# Altium schematic sheet Sheet5.SchDoc
size A0
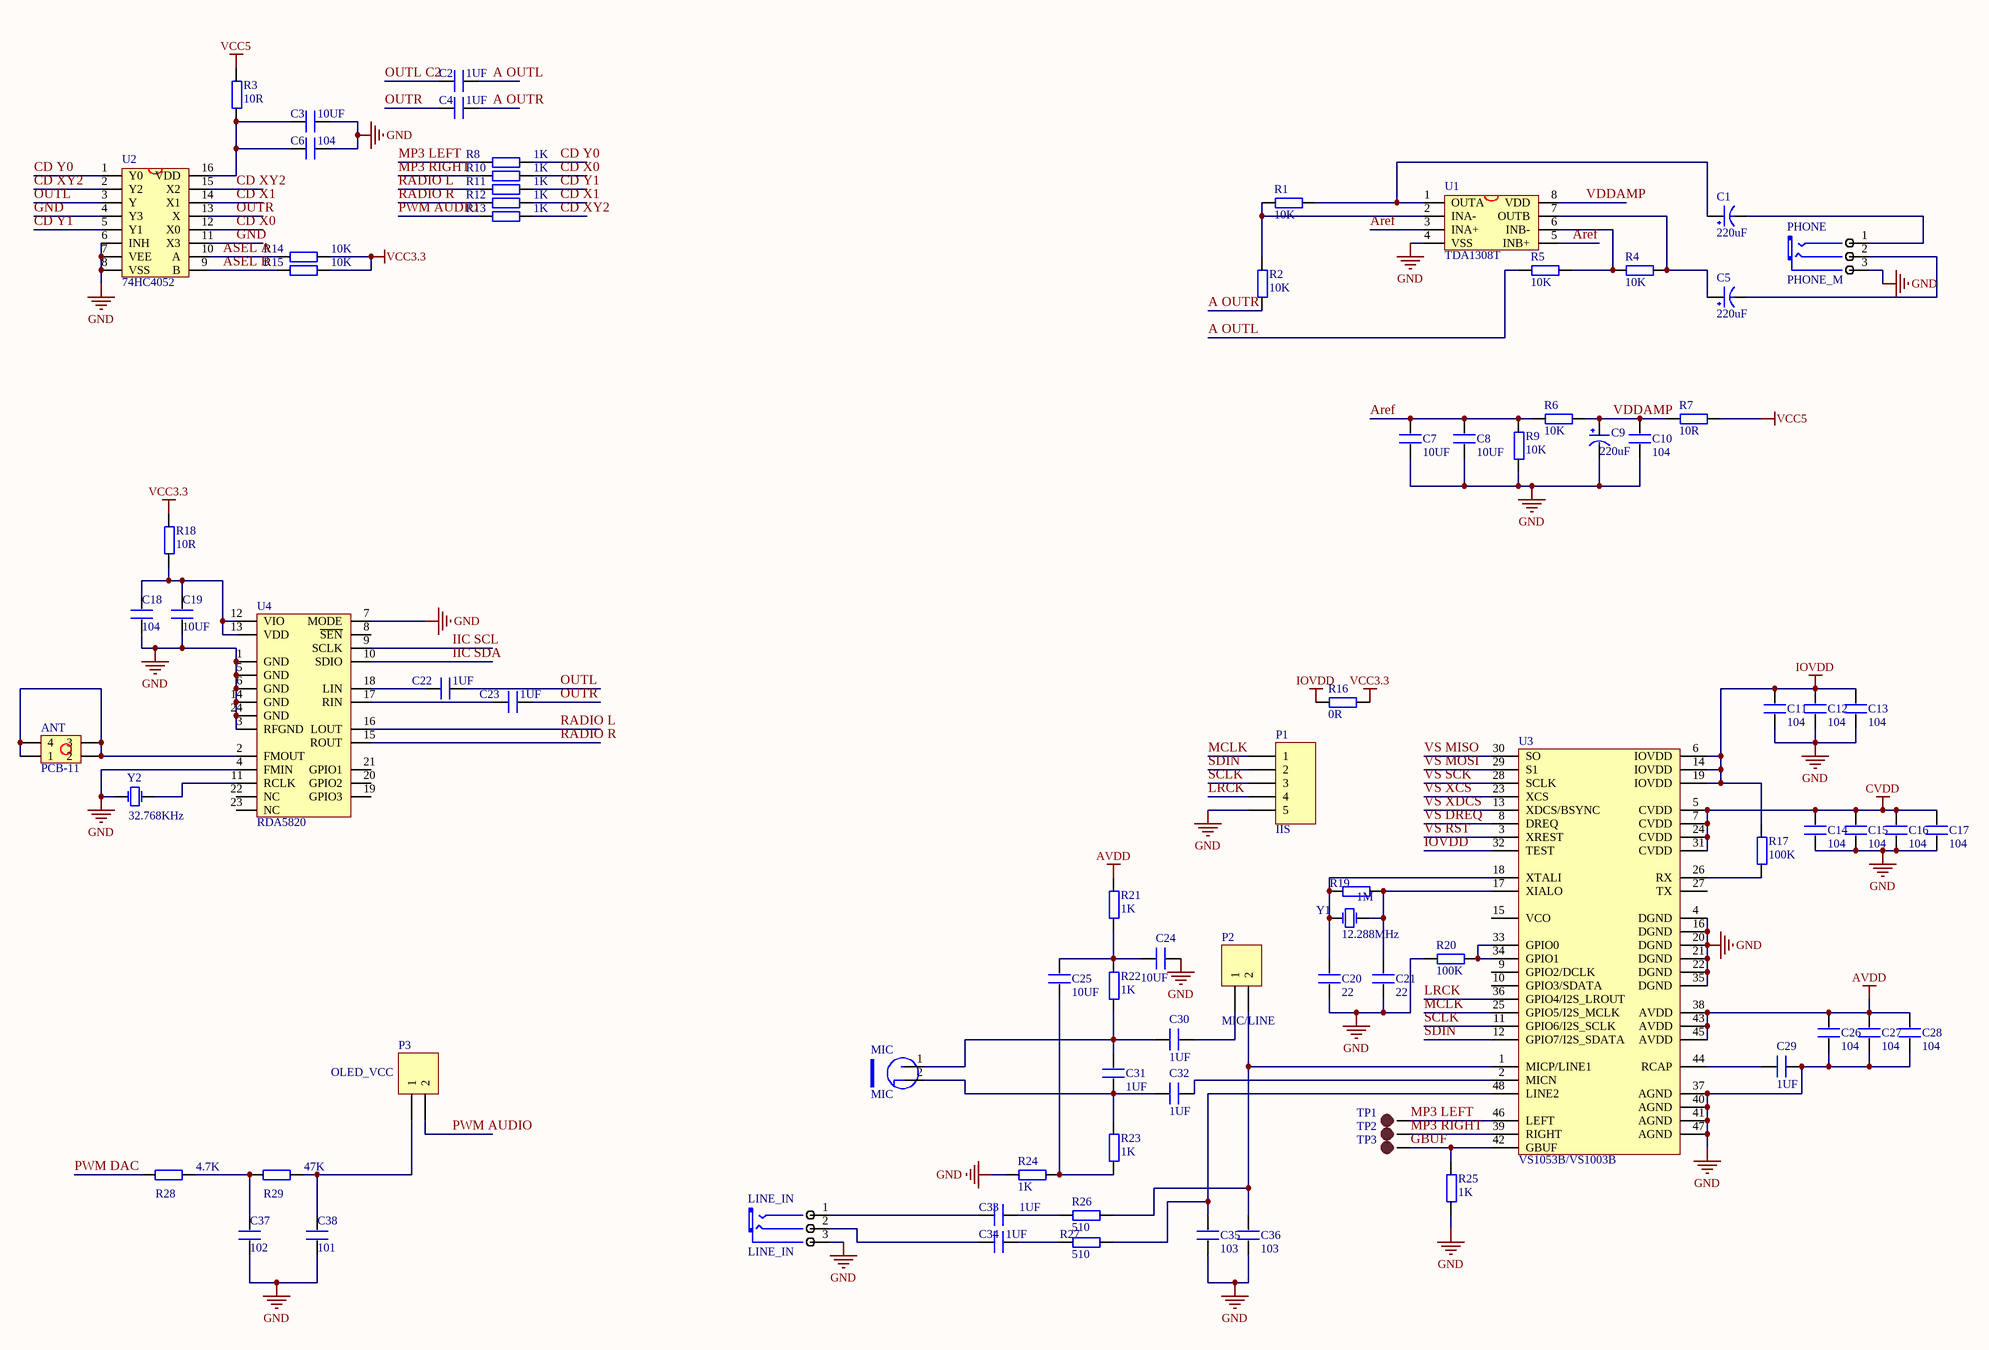
[diagram p0: Sheet5.SchDoc]

## Parts
ANT  PCB-11  [PCB-11]
C1  220uF  [CC6.56.5]
C2  1UF  [0603P]
C3  10UF  [0603P]
C4  1UF  [0603P]
C5  220uF  [CC6.56.5]
C6  104  [0603P]
C7  10UF  [0603P]
C8  10UF  [0603P]
C9  220uF  [CC6.56.5]
C10  104  [0603P]
C11  104  [0603P]
C12  104  [0603P]
C13  104  [0603P]
C14  104  [0603P]
C15  104  [0603P]
C16  104  [0603P]
C17  104  [0603P]
C18  104  [0603P]
C19  10UF  [0603P]
C20  22  [0603P]
C21  22  [0603P]
C22  1UF  [0603P]
C23  1UF  [0603P]
C24  10UF  [0603P]
C25  10UF  [0603P]
C26  104  [0603P]
C27  104  [0603P]
C28  104  [0603P]
C29  1UF  [0603P]
C30  1UF  [0603P]
C31  1UF  [0603P]
C32  1UF  [0603P]
C33  1UF  [0603P]
C34  1UF  [0603P]
C35  103  [0603P]
C36  103  [0603P]
C37  102  [0603P]
C38  101  [0603P]
LINE_IN  LINE_IN  [PHONE_ST]
MIC  MIC  [MIC]
P1  IIS  [HDR1X5]
P2  MIC/LINE  [HDR1X2]
P3  OLED_VCC  [HDR1X2]
PHONE  PHONE_M  [PHONE_ST]
R1  10K  [0603P]
R2  10K  [0603P]
R3  10R  [0603P]
R4  10K  [0603P]
R5  10K  [0603P]
R6  10K  [0603P]
R7  10R  [0603P]
R8  1K  [0603P]
R9  10K  [0603P]
R10  1K  [0603P]
R11  1K  [0603P]
R12  1K  [0603P]
R13  1K  [0603P]
R14  10K  [0603P]
R15  10K  [0603P]
R16  0R  [0603P]
R17  100K  [0603P]
R18  10R  [0603P]
R19  1M  [0603P]
R20  100K  [0603P]
R21  1K  [0603P]
R22  1K  [0603P]
R23  1K  [0603P]
R24  1K  [0603P]
R25  1K  [0603P]
R26  510  [0603P]
R27  510  [0603P]
R28  4.7K  [0603P]
R29  47K  [0603P]
TP1  TEST POINT  [TP-1.5]  (value not drawn)
TP2  TEST POINT  [TP-1.5]  (value not drawn)
TP3  TEST POINT  [TP-1.5]  (value not drawn)
U1  TDA1308T  [SOP-8]
U2  74HC4052  [SOP16M]
U3  VS1053B/VS1003B  [mTQFP48]
U4  RDA5820  [QFN24]
Y1  12.288MHz  [XTAL_US]
Y2  32.768KHz  [XTAL32]

## Nets
AVDD: C26.2 C27.2 C28.2 R21.2 U3.38(AVDD) U3.43(AVDD) U3.45(AVDD)
CVDD: C14.2 C15.2 C16.2 C17.2 U3.5(CVDD) U3.7(CVDD) U3.24(CVDD) U3.31(CVDD)
GND: C3.2 C6.2 C7.1 C8.1 C9.2(GND) C10.1 C11.1 C12.1 C13.1 C14.1 C15.1 C16.1 C17.1 C18.1 C19.1 C20.1 C21.1 C24.1 C26.1 C27.1 C28.1 C29.2 C35.1 C36.1 C37.1 C38.1 LINE_IN.3(COM) P1.5 PHONE.3(COM) R9.1 R20.1 R24.1 R25.1 U1.4(VSS) U2.4(Y3) U2.6(INH) U2.7(VEE) U2.8(VSS) U2.11(X3) U3.4(DGND) U3.16(DGND) U3.20(DGND) U3.21(DGND) U3.22(DGND) U3.35(DGND) U3.37(AGND) U3.40(AGND) U3.41(AGND) U3.47(AGND) U4.1(GND) U4.3(RFGND) U4.4(FMIN) U4.5(GND) U4.6(GND) U4.7(MODE) U4.14(GND) U4.24(GND) Y2.1(OSC1)
IOVDD: C11.2 C12.2 C13.2 R16.1 R17.2 U3.6(IOVDD) U3.14(IOVDD) U3.19(IOVDD) U3.32(TEST)
VCC3.3: R14.2 R15.2 R16.2 R18.2
VCC5: R3.2 R7.2
A OUTL: C2.2 R5.1
A OUTR: C4.2 R2.1
Aref: C7.2 C8.2 R6.1 R9.2 U1.3(INA+) U1.5(INB+)
ASEL A: R14.1 U2.10(A)
ASEL B: R15.1 U2.9(B)
CD X0: R10.2 U2.12(X0)
CD X1: R12.2 U2.14(X1)
CD XY2: R13.2 U2.2(Y2) U2.15(X2)
CD Y0: R8.2 U2.1(Y0)
CD Y1: R11.2 U2.5(Y1)
GBUF: R25.2 TP3.1 U3.42(GBUF)
IIC SCL: U4.9(SCLK)
IIC SDA: U4.10(SDIO)
LRCK: P1.4 U3.36(GPIO4/I2S_LROUT)
MCLK: P1.1 U3.25(GPIO5/I2S_MCLK)
MP3 LEFT: R8.1 TP1.1 U3.46(LEFT)
MP3 RIGHT: R10.1 TP2.1 U3.39(RIGHT)
OUTL: C22.1 U2.3(Y)
OUTL C2: C2.1
OUTR: C4.1 C23.1 U2.13(X)
PWM AUDIO: P3.2 R13.1
PWM DAC: R28.1
RADIO L: R11.1 U4.16(LOUT)
RADIO R: R12.1 U4.15(ROUT)
SCLK: P1.3 U3.11(GPIO6/I2S_SCLK)
SDIN: P1.2 U3.12(GPIO7/I2S_SDATA)
VDDAMP: C9.1(VCC) C10.2 R6.2 R7.1 U1.8(VDD)
VS DREQ: U3.8(DREQ)
VS MISO: U3.30(SO)
VS MOSI: U3.29(S1)
VS RST: U3.3(XREST)
VS SCK: U3.28(SCLK)
VS XCS: U3.23(XCS)
VS XDCS: U3.13(XDCS/BSYNC)
NetANT_1: ANT.1 ANT.2 ANT.3 ANT.4 U4.2(FMOUT)
NetC1_1: C1.1(VCC) R1.2 U1.1(OUTA)
NetC1_2: C1.2(GND) PHONE.1(CHL)
NetC3_1: C3.1 C6.1 R3.1 U2.16(VDD)
NetC5_1: C5.1(VCC) R4.2 U1.7(OUTB)
NetC5_2: C5.2(GND) PHONE.2(CHR)
NetC18_2: C18.2 C19.2 R18.1 U4.12(VIO) U4.13(VDD)
NetC20_2: C20.2 R19.1 U3.18(XTALI) Y1.1(OSC1)
NetC21_2: C21.2 R19.2 U3.17(XIALO) Y1.2(OSC2)
NetC22_2: C22.2 U4.18(LIN)
NetC23_2: C23.2 U4.17(RIN)
NetC24_2: C24.2 C25.2 R21.1 R22.2
NetC25_1: C25.1 R23.1 R24.2
NetC29_1: C29.1 U3.44(RCAP)
NetC30_1: C30.1 C31.2 MIC.1(VCC) R22.1
NetC30_2: C30.2 P2.1
NetC31_1: C31.1 C32.1 MIC.2(GND) R23.2
NetC32_2: C32.2 U3.2(MICN)
NetC33_1: C33.1 LINE_IN.1(CHL)
NetC33_2: C33.2 R26.1
NetC34_1: C34.1 LINE_IN.2(CHR)
NetC34_2: C34.2 R27.1
NetC35_2: C35.2 R27.2 U3.48(LINE2)
NetC36_2: C36.2 P2.2 R26.2 U3.1(MICP/LINE1)
NetC37_2: C37.2 R28.2 R29.1
NetC38_2: C38.2 P3.1 R29.2
NetR1_1: R1.1 R2.2 U1.2(INA-)
NetR4_1: R4.1 R5.2 U1.6(INB-)
NetR17_1: R17.1 U3.26(RX)
NetR20_2: R20.2 U3.33(GPIO0) U3.34(GPIO1)
NetU4_11: U4.11(RCLK) Y2.2(OSC2)

Not connected (* = marked no-connect by the designer): U3 9(GPIO2/DCLK) 10(GPIO3/SDATA) 15(VCO) 27(TX); U4 8(~{SEN}) 19(GPIO3) 20(GPIO2) 21(GPIO1) 22(NC) 23(NC)

## Library data of the parts
ANT = PCB-11: PCB接线端子
C1 C5 C9 = CAP
C2-C4 C6-C8 C10-C38 = C
LINE_IN = PHONE_M
P1 = Header 5: Header, 5-Pin; LatestRevisionDate: 17-Jul-2002; LatestRevisionNote: Re-released for DXP Platform.; Publisher: Altium Limited
P2 P3 = Header 2: Header, 2-Pin; LatestRevisionDate: 17-Jul-2002; LatestRevisionNote: Re-released for DXP Platform.; Publisher: Altium Limited
R1-R29 = R
TP1-TP3 = TEST-POINT: 测试点
U1 = TDA1308
U2 = CD4052
U3 = VS1053
Y1 = XTAL_2: Crystal Oscillator; Published: 8-Jun-2000; LatestRevisionDate: 17-Jul-2002; LatestRevisionNote: Re-released for DXP Platform.; Publisher: Altium Limited
Y2 = XTAL_3: 32.768K; Published: 8-Jun-2000; LatestRevisionDate: 17-Jul-2002; LatestRevisionNote: Re-released for DXP Platform.; Publisher: Altium Limited